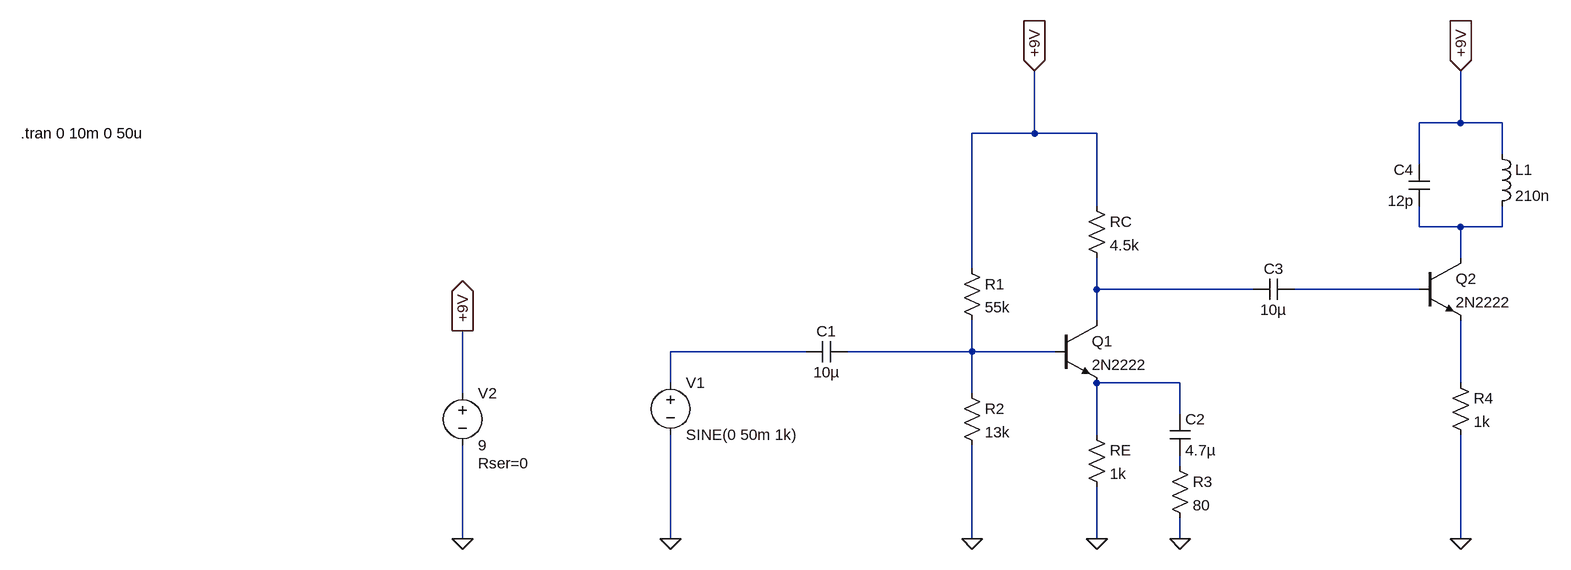
[diagram p0: schematic MY_CE_AMP_1.asc]
MY_CE_AMP_1.asc, the LTspice schematic file:
Version 4
SHEET 1 1156 680
WIRE 976 -240 976 -320
WIRE 976 -240 912 -240
WIRE 1040 -240 976 -240
WIRE 320 -224 320 -320
WIRE 320 -224 224 -224
WIRE 416 -224 320 -224
WIRE 1040 -192 1040 -240
WIRE 912 -176 912 -240
WIRE 416 -112 416 -224
WIRE 912 -80 912 -112
WIRE 976 -80 912 -80
WIRE 1040 -80 1040 -112
WIRE 1040 -80 976 -80
WIRE 976 -32 976 -80
WIRE 224 -16 224 -224
WIRE 416 16 416 -32
WIRE 656 16 416 16
WIRE 912 16 720 16
WIRE 416 64 416 16
WIRE -32 112 -240 112
WIRE 224 112 224 64
WIRE 224 112 32 112
WIRE 352 112 224 112
WIRE -240 160 -240 112
WIRE 544 160 416 160
WIRE 976 160 976 64
WIRE -560 176 -560 80
WIRE 224 176 224 112
WIRE 544 208 544 160
WIRE 416 240 416 160
WIRE 544 288 544 272
WIRE -560 400 -560 256
WIRE -240 400 -240 240
WIRE 224 400 224 256
WIRE 416 400 416 320
WIRE 544 400 544 368
WIRE 976 400 976 240
FLAG 416 400 0
FLAG 224 400 0
FLAG -560 400 0
FLAG -240 400 0
FLAG -560 80 +9V
IOPIN -560 80 Out
FLAG 320 -320 +9V
IOPIN 320 -320 In
FLAG 544 400 0
FLAG 976 400 0
FLAG 976 -320 +9V
IOPIN 976 -320 In
SYMBOL res 208 -32 R0
SYMATTR InstName R1
SYMATTR Value 55k
SYMATTR SpiceLine tol=5 pwr=15
SYMBOL res 208 160 R0
SYMATTR InstName R2
SYMATTR Value 13k
SYMATTR SpiceLine tol=5 pwr=15
SYMBOL npn 352 64 R0
SYMATTR InstName Q1
SYMATTR Value 2N2222
SYMBOL res 400 -128 R0
SYMATTR InstName RC
SYMATTR Value 4.5k
SYMATTR SpiceLine tol=5 pwr=15
SYMBOL res 400 224 R0
SYMATTR InstName RE
SYMATTR Value 1k
SYMATTR SpiceLine tol=5 pwr=15
SYMBOL cap 32 96 R90
WINDOW 0 0 32 VBottom 2
WINDOW 3 32 32 VTop 2
SYMATTR InstName C1
SYMATTR Value 10µ
SYMATTR SpiceLine V=60 Irms=15 Rser=0 Lser=0 Rpar=0 Cpar=0
SYMBOL voltage -240 144 R0
WINDOW 123 0 0 Left 0
WINDOW 39 0 0 Left 0
SYMATTR InstName V1
SYMATTR Value SINE(0 50m 1k)
SYMBOL voltage -560 160 R0
WINDOW 123 0 0 Left 0
WINDOW 39 24 124 Left 2
SYMATTR SpiceLine Rser=0
SYMATTR InstName V2
SYMATTR Value 9
SYMBOL cap 528 208 R0
SYMATTR InstName C2
SYMATTR Value 4.7µ
SYMATTR SpiceLine V=65 Irms=15 Rser=0 Lser=0 Rpar=0 Cpar=0
SYMBOL res 528 272 R0
SYMATTR InstName R3
SYMATTR Value 80
SYMATTR SpiceLine tol=5 pwr=15
SYMBOL npn 912 -32 R0
SYMATTR InstName Q2
SYMATTR Value 2N2222
SYMBOL cap 720 0 R90
WINDOW 0 0 32 VBottom 2
WINDOW 3 32 32 VTop 2
SYMATTR InstName C3
SYMATTR Value 10µ
SYMATTR SpiceLine V=65 Irms=15 Rser=0 Lser=0 Rpar=0 Cpar=0
SYMBOL cap 928 -112 R180
WINDOW 0 24 56 Left 2
WINDOW 3 24 8 Left 2
SYMATTR InstName C4
SYMATTR Value 12p
SYMATTR SpiceLine V=65 Irms=15 Rser=0 Lser=0 Rpar=0 Cpar=0
SYMBOL ind 1024 -208 R0
SYMATTR InstName L1
SYMATTR Value 210n
SYMATTR SpiceLine Ipk=15 Rser=0 Rpar=0 Cpar=0
SYMBOL res 960 144 R0
SYMATTR InstName R4
SYMATTR Value 1k
SYMATTR SpiceLine tol=5 pwr=15
TEXT -1240 -224 Left 2 !.tran 0 10m 0 50u

The netlist it stands for:
* MY_CE_AMP_1.asc
R1 +9V N005 55k tol=5 pwr=15
R2 N005 0 13k tol=5 pwr=15
Q1 N002 N005 N006 0 2N2222
RC +9V N002 4.5k tol=5 pwr=15
RE N006 0 1k tol=5 pwr=15
C1 N005 N004 10µ V=60 Irms=15 Rser=0 Lser=0 Rpar=0 Cpar=0
V1 N004 0 SINE(0 50m 1k)
V2 +9V 0 9 Rser=0
C2 N006 N008 4.7µ V=65 Irms=15 Rser=0 Lser=0 Rpar=0 Cpar=0
R3 N008 0 80 tol=5 pwr=15
Q2 N001 N003 N007 0 2N2222
C3 N003 N002 10µ V=65 Irms=15 Rser=0 Lser=0 Rpar=0 Cpar=0
C4 N001 +9V 12p V=65 Irms=15 Rser=0 Lser=0 Rpar=0 Cpar=0
L1 +9V N001 210n Ipk=15 Rser=0 Rpar=0 Cpar=0
R4 N007 0 1k tol=5 pwr=15
.model NPN NPN
.model PNP PNP
.lib standard.bjt
.tran 0 10m 0 50u
.backanno
.end